# EAGLE schematic Schemat termometru (EAGLE 9.4.1)
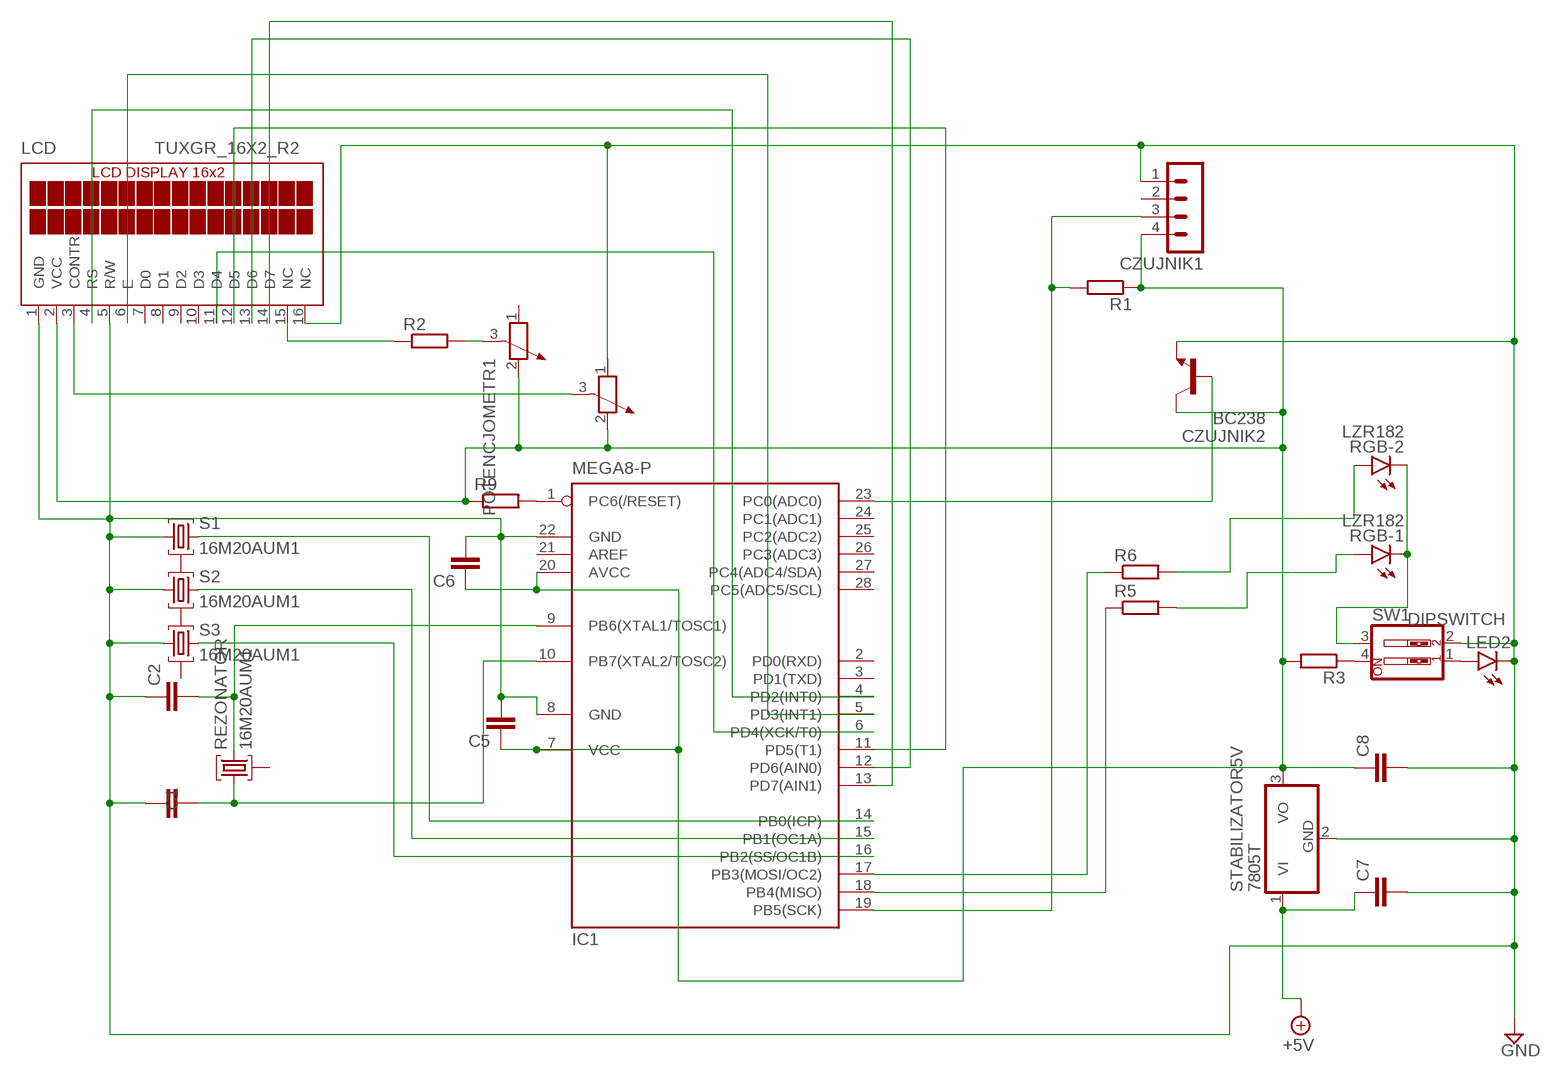
[diagram p0: schematic, sheet 1]

## Parts
C1  C-EU025-040X050  [C025-040X050]
C2  C-EU025-040X050  [C025-040X050]
C5  C-EU025-040X050  [C025-040X050]
C6  C-EU025-040X050  [C025-040X050]
C7  C-EU025-040X050  [C025-040X050]
C8  C-EU025-040X050  [C025-040X050]
CZUJNIK1  MA04-1  [MA04-1]
CZUJNIK2  BC238  [TO92]
IC1  MEGA8-P  [DIL28-3]
LCD  TUXGR_16X2_R2  [TUXGR_16X2_R2]
LED2  LED5MM  [LED5MM]
POTENCJOMETR1  POTENTIOMETER_PT-10  [PT-10]
POTENCJOMETR2  POTENTIOMETER_PT-10  [PT-10]
R1  R-EU_0207/10  [0207/10]
R2  R-EU_0207/10  [0207/10]
R3  R-EU_0207/10  [0207/10]
R5  R-EU_0207/10  [0207/10]
R6  R-EU_0207/10  [0207/10]
R9  R-EU_0207/10  [0207/10]
REZONATOR  16M20AUM1  [UM1]
RGB  LZR182  [LZR182]
S1  16M20AUM1  [UM1]
S2  16M20AUM1  [UM1]
S3  16M20AUM1  [UM1]
STABILIZATOR5V  7805T  [TO220H]
SW1  SW_DIP-2  [EDG-02]

## Nets
+5V: C7.1 STABILIZATOR5V.1(VI)
DIPSWITCH: RGB.K1(-1:C) RGB.K2(-2:C) SW1.3
N$1: R3.1 SW1.4
N$2: IC1.18(PB4(MISO)) R5.1
N$3: R5.2 RGB.A1(-1:A)
N$4: CZUJNIK2.2(B) IC1.23(PC0(ADC0))
N$5: CZUJNIK1.3 IC1.19(PB5(SCK)) R1.2
N$6: IC1.16(PB2(SS/OC1B)) S3.3
N$7: IC1.15(PB1(OC1A)) S2.3
N$8: IC1.14(PB0(ICP)) S1.3
N$9: POTENCJOMETR1.3 R2.2
N$10: LED2.A SW1.1
N$11: LCD.15(NC) R2.1
N$12: IC1.17(PB3(MOSI/OC2)) R6.1
N$13: LCD.3(CONTR) POTENCJOMETR2.3
N$14: R6.2 RGB.A2(-2:A)
N$15: C2.2 IC1.9(PB6(XTAL1/TOSC1)) REZONATOR.3
N$16: IC1.4(PD2(INT0)) LCD.4(RS)
N$17: C1.2 IC1.10(PB7(XTAL2/TOSC2)) REZONATOR.1
N$18: C5.1 C6.1 C8.1 CZUJNIK1.4 CZUJNIK2.3(C) IC1.7(VCC) IC1.20(AVCC) LCD.2(VCC) POTENCJOMETR1.2 POTENCJOMETR2.2 R1.1 R3.2 R9.1 STABILIZATOR5V.3(VO)
N$19: C1.1 C2.1 C5.2 C6.2 C7.2 C8.2 CZUJNIK1.1 CZUJNIK2.1(E) IC1.8(GND) IC1.22(GND) LCD.1(GND) LCD.5(R/W) LCD.16(NC) LED2.K(C) POTENCJOMETR2.1 S1.1 S2.1 S3.1 STABILIZATOR5V.2(GND) SW1.2 ; supply symbol labelled GND
N$20: IC1.1(PC6(/RESET)) R9.2
N$21: IC1.5(PD3(INT1)) LCD.6(E)
N$22: IC1.13(PD7(AIN1)) LCD.14(D7)
N$23: IC1.12(PD6(AIN0)) LCD.13(D6)
N$24: IC1.11(PD5(T1)) LCD.12(D5)
N$25: IC1.6(PD4(XCK/T0)) LCD.11(D4)
Unconnected: CZUJNIK1.2 IC1.2(PD0(RXD)) IC1.3(PD1(TXD)) IC1.21(AREF) IC1.24(PC1(ADC1)) IC1.25(PC2(ADC2)) IC1.26(PC3(ADC3)) IC1.27(PC4(ADC4/SDA)) IC1.28(PC5(ADC5/SCL)) LCD.7(D0) LCD.8(D1) LCD.9(D2) LCD.10(D3) POTENCJOMETR1.1 REZONATOR.2 S1.2 S2.2 S3.2

## Library data of the parts
C1 C2 C5-C8 = rcl:C-EU: CAPACITOR, European symbol; SPICEPREFIX: C
CZUJNIK1 = con-lstb:MA04-1: PIN HEADER; OC_FARNELL: unknown; OC_NEWARK: unknown
CZUJNIK2 = transistor-neu-to92:BC238: NPN TRANSISTOR
IC1 = atmel:MEGA8-P: MICROCONTROLLER 8 Kbytes FLASH, 1 kbytes SRAM, 512 bytes EEPROM, USART, 4-channel 10 bit ADC, 2-channel 8 bit ADC Pin compatible with Atmega48, ATMega88, ATMega168 Source: avr.lbr; OC_FARNELL: unknown; OC_NEWARK: unknown
LCD = display-lcd:TUXGR_16X2_R2: Tuxgraphics LCD display 16x2 characters reflective, without background light Source: tuxgr_12x2_r2.pdf; OC_FARNELL: unknown; OC_NEWARK: unknown
LED2 = led:LED: LED OSRAM: - CHIPLED LG R971, LG N971, LY N971, LG Q971, LY Q971, LO R971, LY R971 LH N974, LH R974 LS Q976, LO Q976, LY Q976 LO Q996 - Hyper CHIPLED LW Q18S LB Q993, LB Q99A, LB R99A - SideLED LS A670, LO A670, LY A670, LG A670, LP A670 LB A673, LV A673, LT A673, LW A673 LH A674 LY A675 LS A676, LA A676, LO A676, LY A676, LW A676 LS A679, LY A679, LG A679 - Hyper Micro SIDELED® LS Y876, LA Y876, LO Y876, LY Y876 LT Y87S - SmartLED LW L88C, LW L88S LB L89C, LB L89S, LG L890 LS L89K, LO L89K, LY L89K LS L896, LA L896, LO L896, LY L896 - TOPLED LS T670, LO T670, LY T670, LG T670, LP T670 LSG T670, LSP T670, LSY T670, LOP T670, LYG T670 LG T671, LOG T671, LSG T671 LB T673, LV T673, LT T673, LW T673 LH T674 LS T676, LA T676, LO T676, LY T676, LB T676, LH T676, LSB T676, LW T676 LB T67C, LV T67C, LT T67C, LS T67K, LO T67K, LY T67K, LW E67C LS E67B, LA E67B, LO E67B, LY E67B, LB E67C, LV E67C, LT E67C LW T67C LS T679, LY T679, LG T679 LS T770, LO T770, LY T770, LG T770, LP T770 LB T773, LV T773, LT T773, LW T773 LH T774 LS E675, LA E675, LY E675, LS T675 LS T776, LA T776, LO T776, LY T776, LB T776 LHGB T686 LT T68C, LB T68C - Hyper Mini TOPLED® LB M676 - Mini TOPLED Santana® LG M470 LS M47K, LO M47K, LY M47K Source: http://www.osram.convergy.de LUXEON: - LUMILED® LXK2-PW12-R00, LXK2-PW12-S00, LXK2-PW14-U00, LXK2-PW14-V00 LXK2-PM12-R00, LXK2-PM12-S00, LXK2-PM14-U00 LXK2-PE12-Q00, LXK2-PE12-R00, LXK2-PE12-S00, LXK2-PE14-T00, LXK2-PE14-U00 LXK2-PB12-K00, LXK2-PB12-L00, LXK2-PB12-M00, LXK2-PB14-N00, LXK2-PB14-P00, LXK2-PB14-Q00 LXK2-PR12-L00, LXK2-PR12-M00, LXK2-PR14-Q00, LXK2-PR14-R00 LXK2-PD12-Q00, LXK2-PD12-R00, LXK2-PD12-S00 LXK2-PH12-R00, LXK2-PH12-S00 LXK2-PL12-P00, LXK2-PL12-Q00, LXK2-PL12-R00 Source: www.luxeon.com KINGBRIGHT: KA-3528ASYC Source: www.kingbright.com
POTENCJOMETR1 POTENCJOMETR2 = rcl:POTENTIOMETER_: Potentiometer; SPICEMODEL: POT; SPICEPREFIX: X
R1-R3 R5 R6 R9 = rcl:R-EU_: RESISTOR, European symbol; SPICEPREFIX: R
REZONATOR S1-S3 = crystal:16M20AUM1: Monolithic Crystal Filters Source: www.vanlong.com; OC_FARNELL: unknown; OC_NEWARK: unknown
RGB = led:LZR182: LED BLOCK 2 LEDs, Siemens
STABILIZATOR5V = linear:78*: Positive VOLTAGE REGULATOR Source: http://cache.national.com/ds/LM/LM78L05.pdf http://www.fairchildsemi.com/ds/LM/LM7805.pdf
SW1 = special:SW_DIP-2: DIP SWITCH